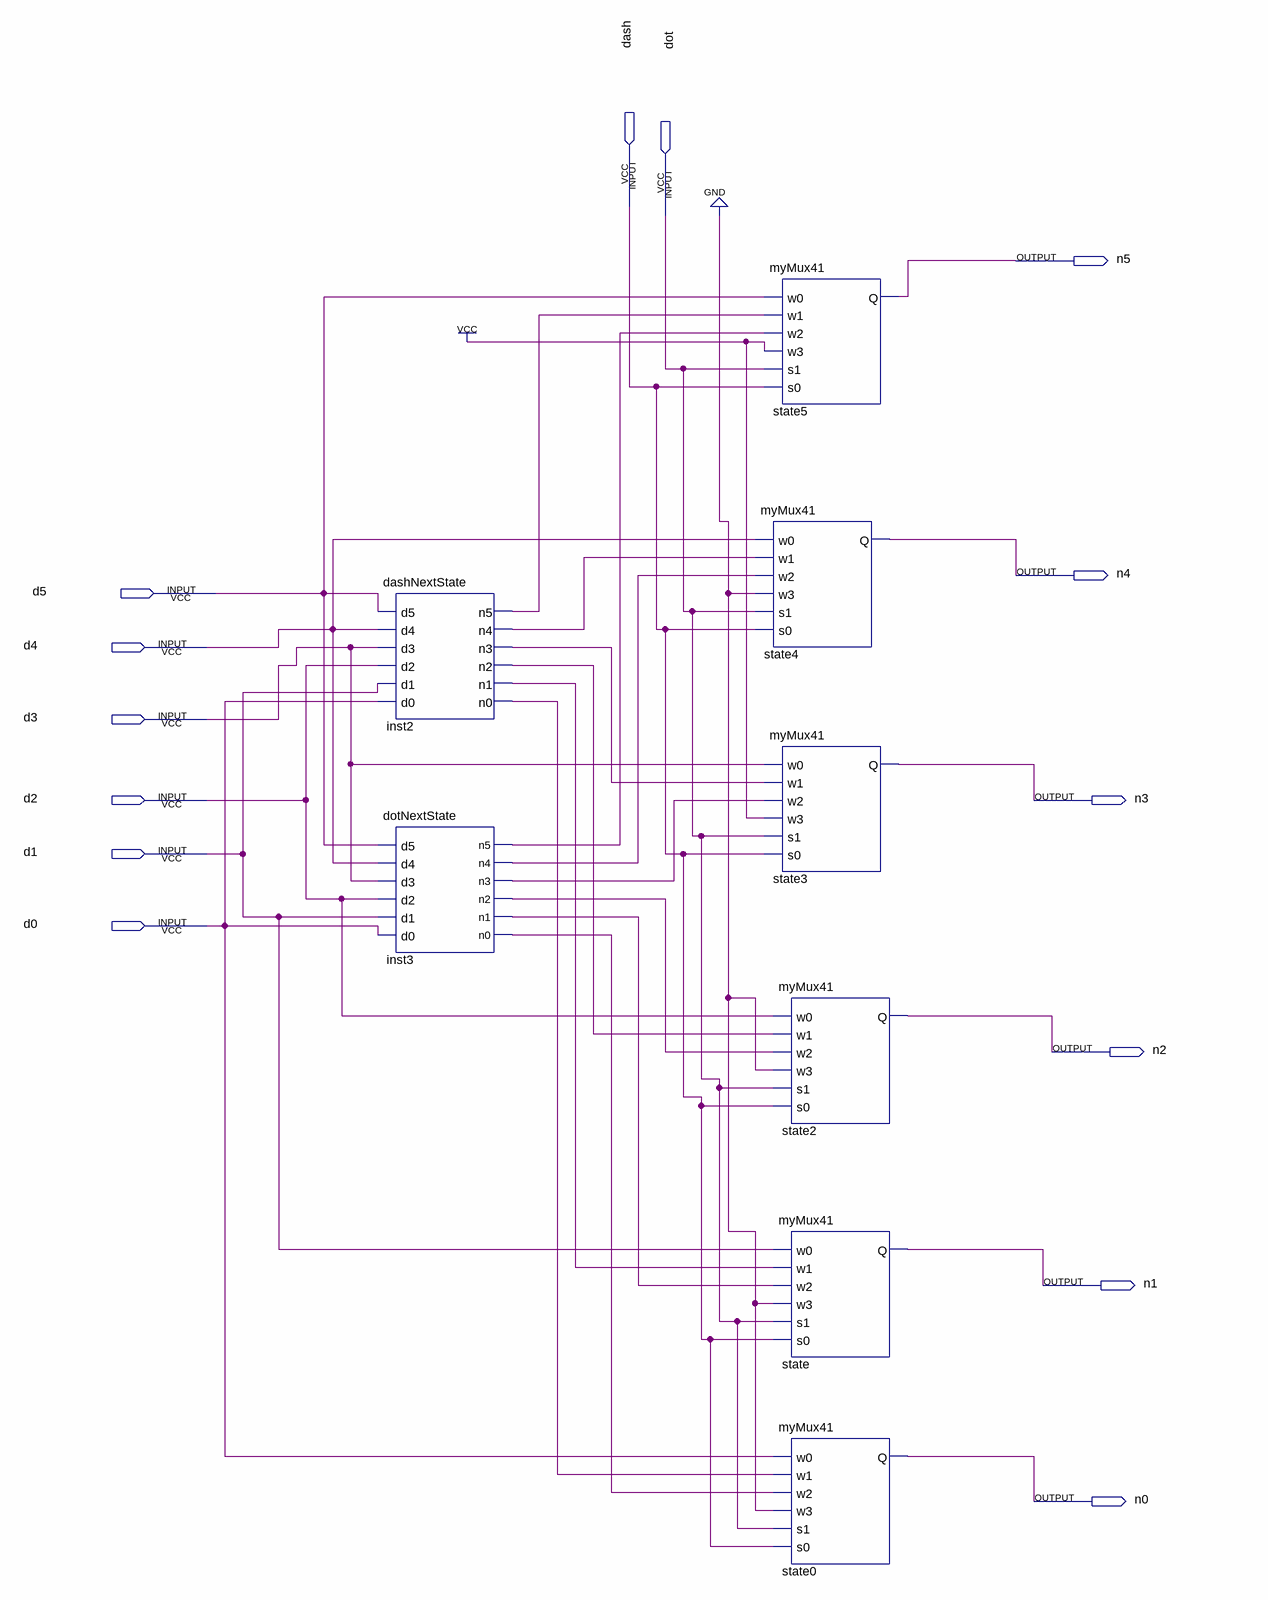
[diagram p0: schematic sheet]
// Quartus schematic nextStateCircuit.bdf as structural Verilog: 8 symbols, 14 pins
module nextStateCircuit (
  input  dash,
  input  dot,
  input  d5,
  input  d4,
  input  d3,
  input  d2,
  input  d1,
  input  d0,
  output n5,
  output n4,
  output n3,
  output n2,
  output n1,
  output n0
);

  wire inst2_n0, inst2_n1, inst2_n2, inst2_n3, inst2_n4, inst2_n5, inst3_n0, inst3_n1, inst3_n2, inst3_n3,
       inst3_n4, inst3_n5;

  dashNextState inst2 (
    .d5(d5), .d4(d4), .d3(d3), .d2(d2), .d1(d1), .d0(d0), .n5(inst2_n5), .n4(inst2_n4), .n3(inst2_n3),
    .n2(inst2_n2), .n1(inst2_n1), .n0(inst2_n0));
  dotNextState inst3 (
    .d5(d5), .d4(d4), .d3(d3), .d2(d2), .d1(d1), .d0(d0), .n5(inst3_n5), .n4(inst3_n4), .n3(inst3_n3),
    .n2(inst3_n2), .n1(inst3_n1), .n0(inst3_n0));
  myMux41 state5 (.w0(d5), .w1(inst2_n5), .w2(inst3_n5), .w3(1'b1), .s1(dot), .s0(dash), .Q(n5));
  myMux41 state4 (.w0(d4), .w1(inst2_n4), .w2(inst3_n4), .w3(1'b0), .s1(dot), .s0(dash), .Q(n4));
  myMux41 state3 (.w0(d3), .w1(inst2_n3), .w2(inst3_n3), .w3(1'b1), .s1(dot), .s0(dash), .Q(n3));
  myMux41 state2 (.w0(d2), .w1(inst2_n2), .w2(inst3_n2), .w3(1'b0), .s1(dot), .s0(dash), .Q(n2));
  myMux41 state (.w0(d1), .w1(inst2_n1), .w2(inst3_n1), .w3(1'b0), .s1(dot), .s0(dash), .Q(n1));
  myMux41 state0 (.w0(d0), .w1(inst2_n0), .w2(inst3_n0), .w3(1'b0), .s1(dot), .s0(dash), .Q(n0));
endmodule
